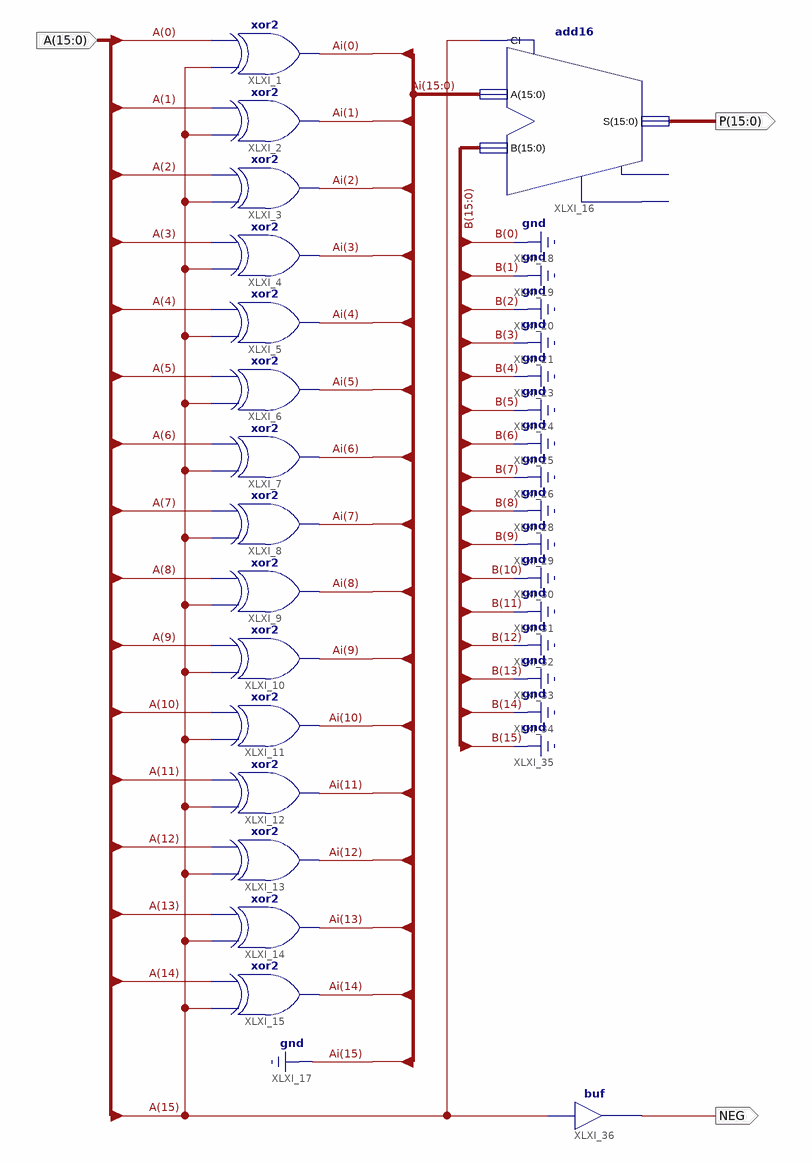
[diagram p0: schematic sheet 1]
// Xilinx ISE schematic tcd16.sch (spartan6) as structural Verilog: 17 symbols, 3 ports
module tcd16 (
  input  [15:0] A,
  output NEG,
  output [15:0] P
);

  wire [14:0] Ai;

  xor XLXI_1 (Ai[0], A[15], A[0]);
  xor XLXI_2 (Ai[1], A[15], A[1]);
  xor XLXI_3 (Ai[2], A[15], A[2]);
  xor XLXI_4 (Ai[3], A[15], A[3]);
  xor XLXI_5 (Ai[4], A[15], A[4]);
  xor XLXI_6 (Ai[5], A[15], A[5]);
  xor XLXI_7 (Ai[6], A[15], A[6]);
  xor XLXI_8 (Ai[7], A[15], A[7]);
  xor XLXI_9 (Ai[8], A[15], A[8]);
  xor XLXI_10 (Ai[9], A[15], A[9]);
  xor XLXI_11 (Ai[10], A[15], A[10]);
  xor XLXI_12 (Ai[11], A[15], A[11]);
  xor XLXI_13 (Ai[12], A[15], A[12]);
  xor XLXI_14 (Ai[13], A[15], A[13]);
  xor XLXI_15 (Ai[14], A[15], A[14]);
  add16 XLXI_16 (.A({1'b0, Ai}), .B({16{1'b0}}), .CI(A[15]), .S(P));  // open: CO, OFL
  buf XLXI_36 (NEG, A[15]);
endmodule
